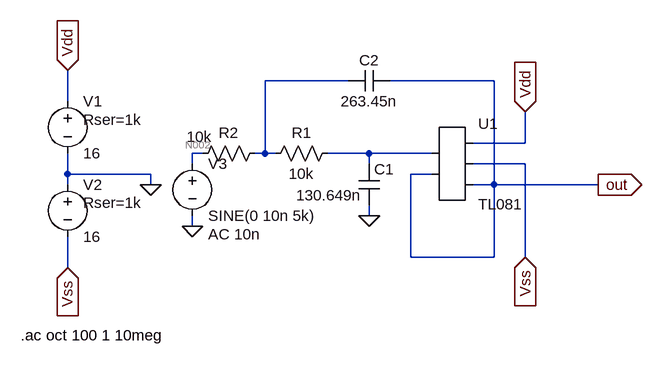
[diagram p0: schematic Butter_2nd.asc]
* Butter_2nd.asc
* U1: TL081 (symbol AutoGenerated\TL081 not available, pins judged from their places): pin1=N003 pin2=out pin3=Vdd pin4=Vss pin5=out
R1 N003 N001 10k tol=5 pwr=0.25
R2 N001 N002 10k tol=5 pwr=0.25
C1 N003 0 130.649n V=50 Rser=0.1
C2 out N001 263.45n V=50 Rser=0.1
V1 Vdd 0 16 Rser=1k
V2 0 Vss 16 Rser=1k
V3 N002 0 SINE(0 10n 5k) AC 10n
.ac oct 100 1 10meg
.backanno
.end

* Results of the author's LTspice run, read from the files saved beside the schematic
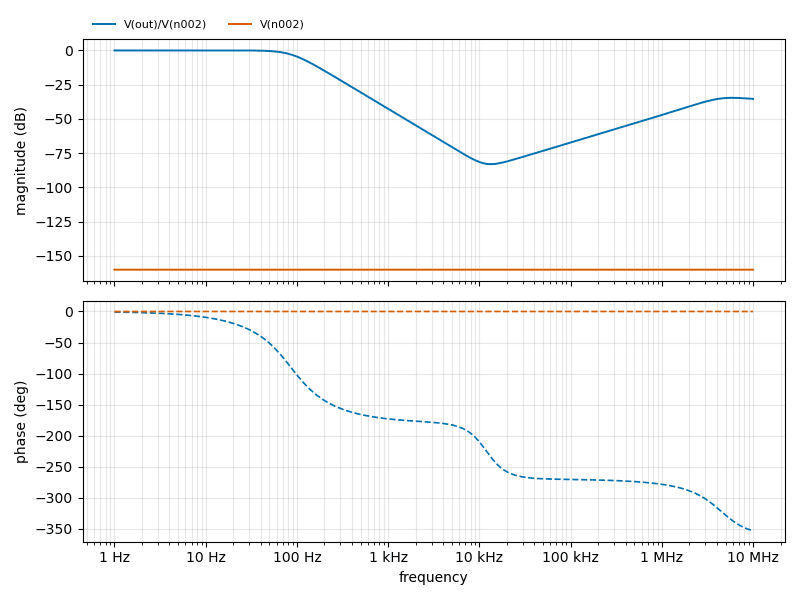
[diagram p1: AC Analysis of Butter_2nd.asc, plotted from the saved traces]
* AC Analysis, 1 run:
*   V(out)/V(n002): -0.00 dB at 1 Hz, -35.36 dB at 10 MHz, peak 0.00 dB at 7.727 Hz, 3 dB below the peak at 86.13 Hz
*   V(n002): -160.00 dB at 1 Hz, -160.00 dB at 10 MHz, peak -160.00 dB at 1 Hz